# Altium schematic sheet Main.SchDoc
size 384 x 574 mm; SheetNumber: 1
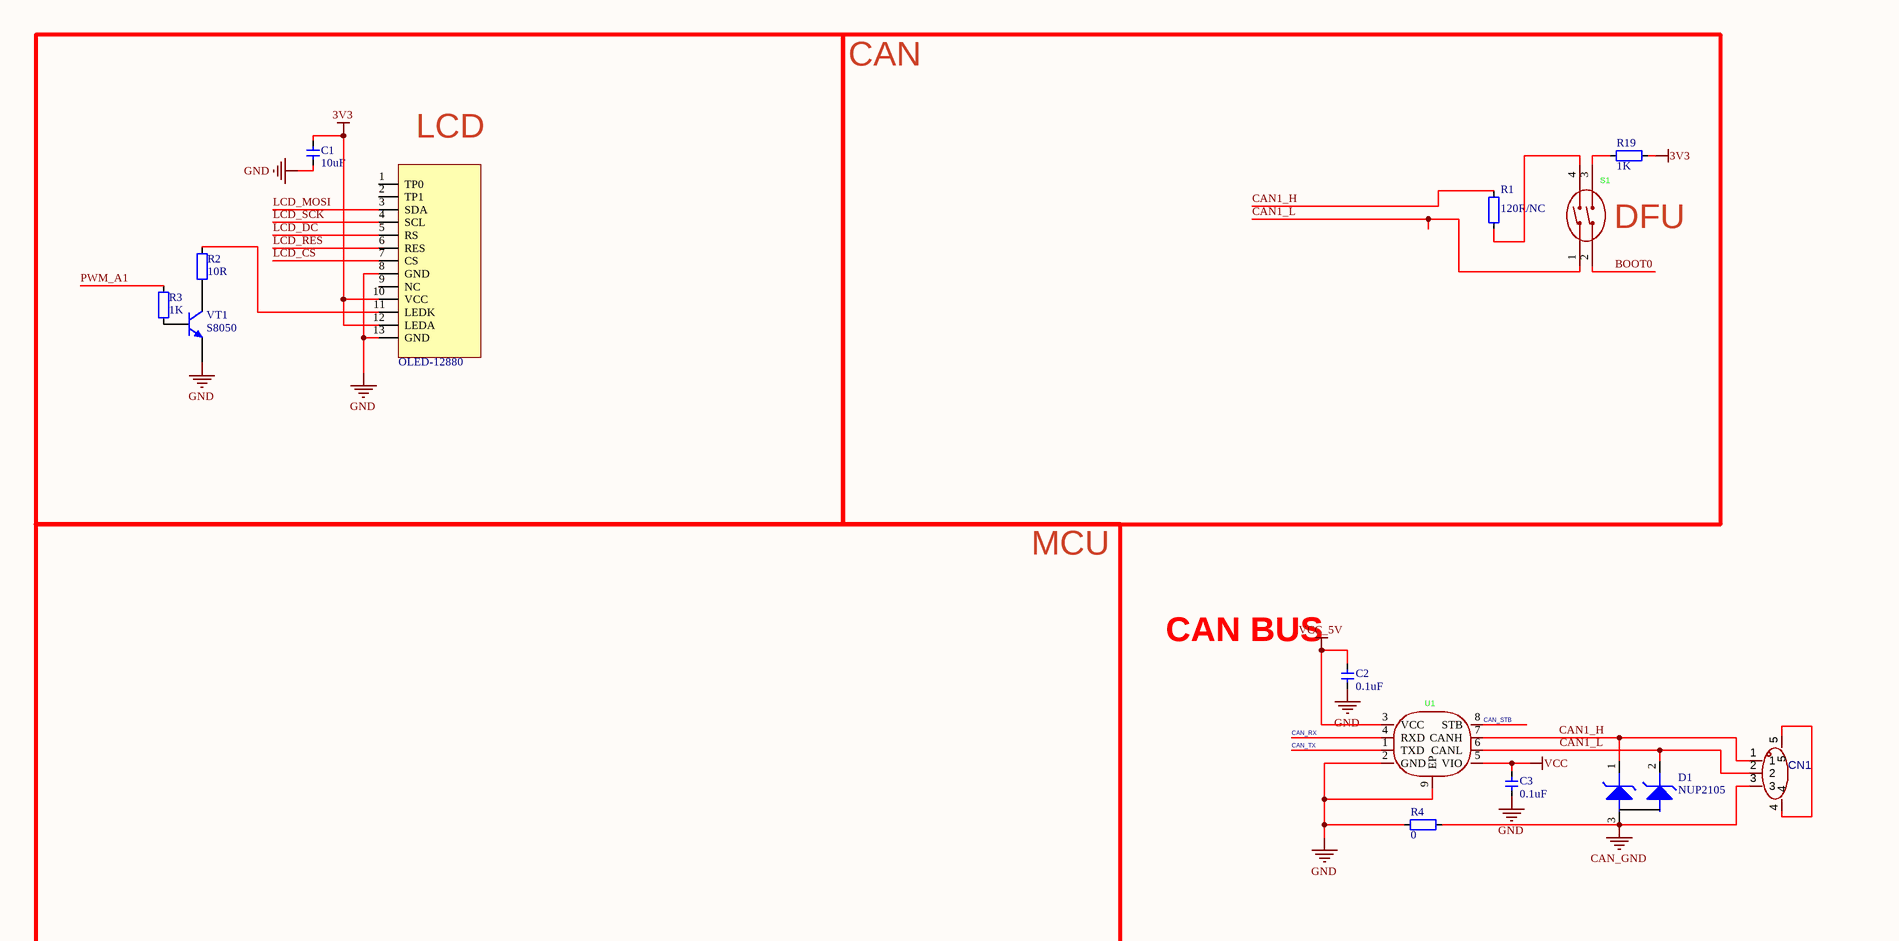
[diagram p0: Main.SchDoc, top]
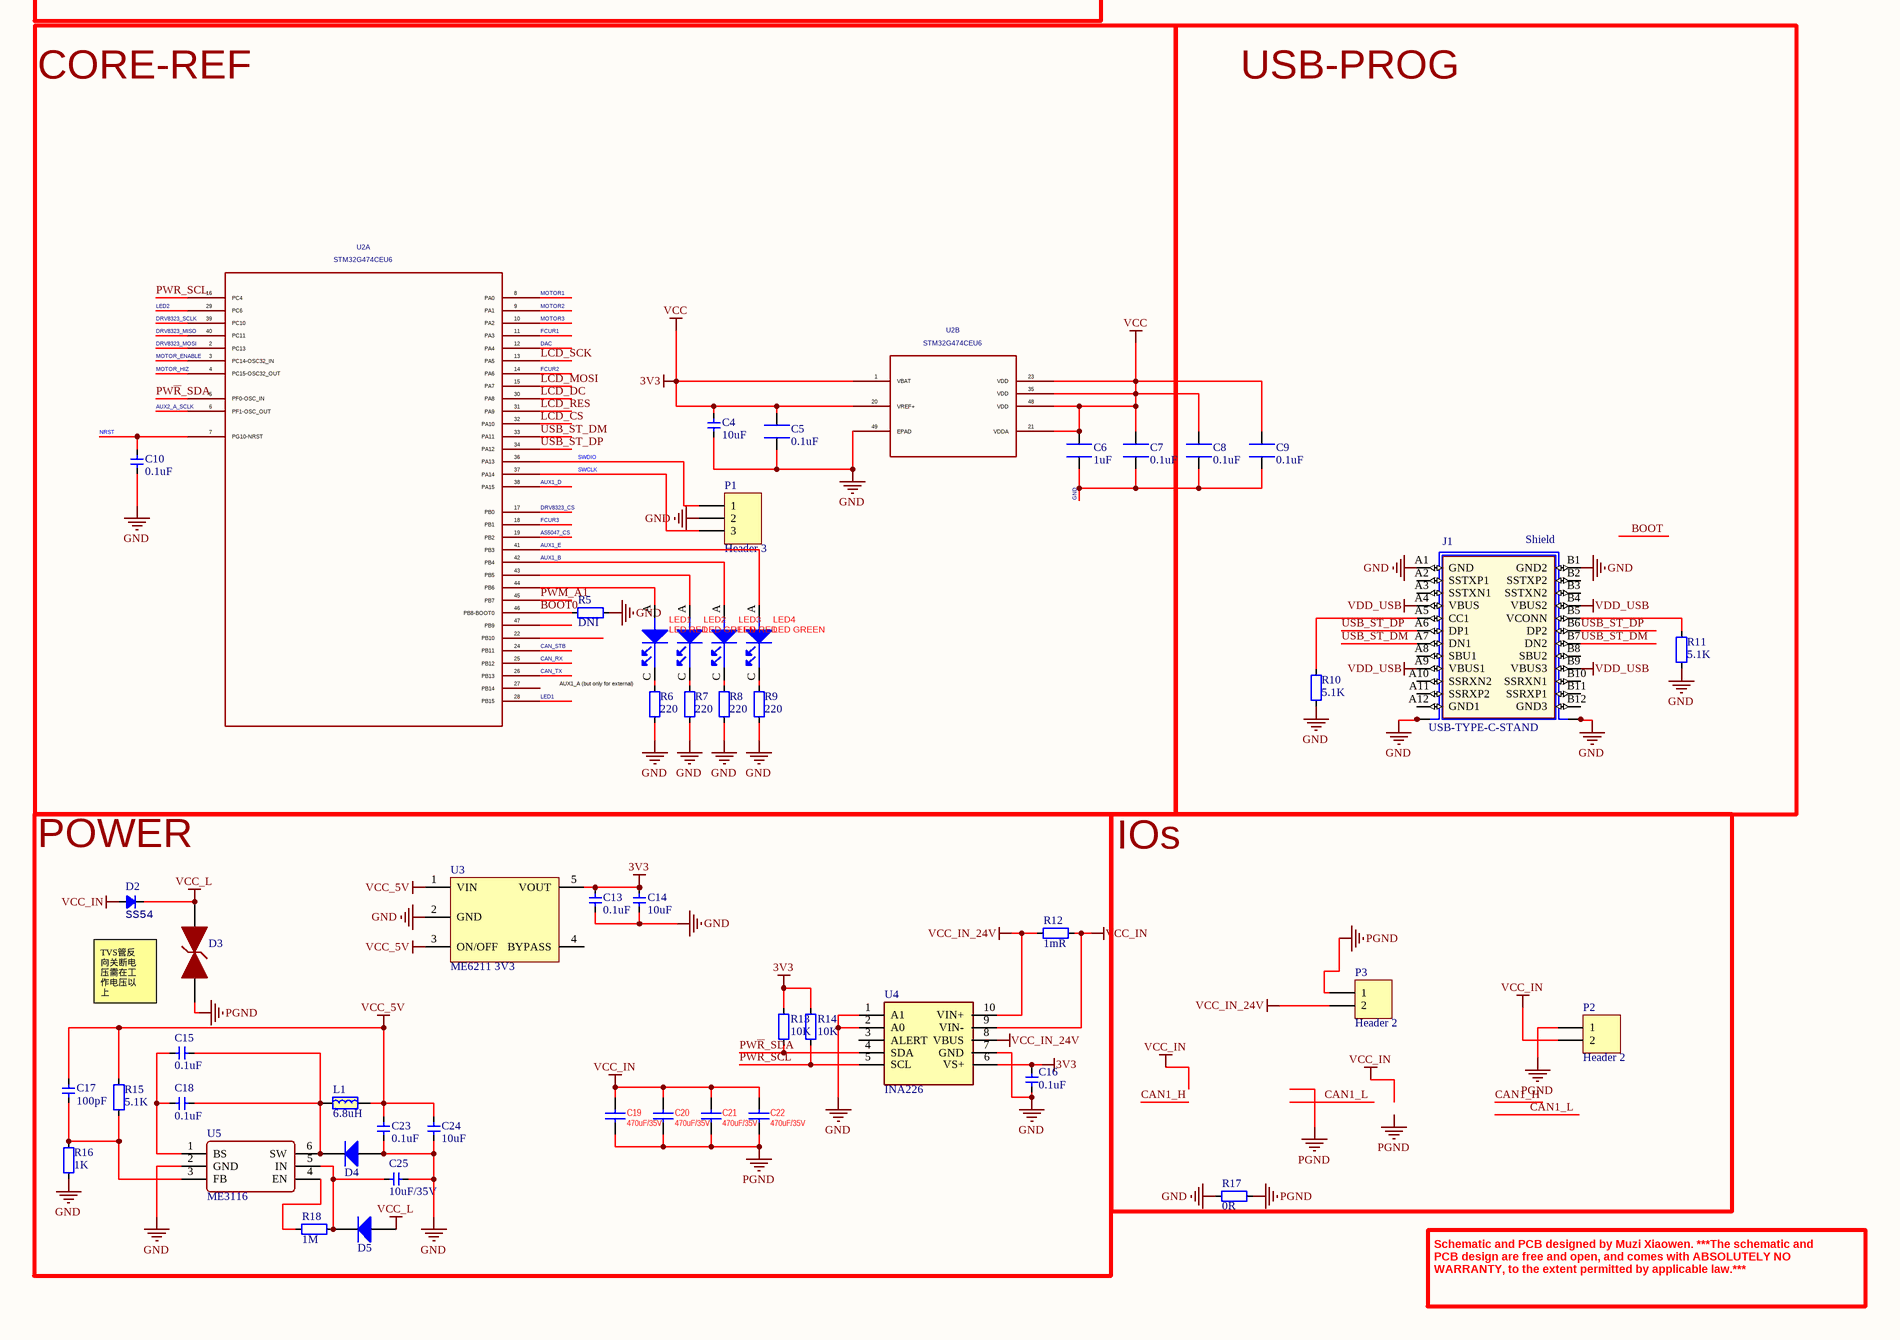
[diagram p1: Main.SchDoc, bottom]

## Parts
1  OLED-12880  [OLED-12880]
C1  10uF  [CAP_0402]
C2  0.1uF  [CAP_0402]
C3  0.1uF  [CAP_0402]
C4  10uF  [CAP_0402]
C5  0.1uF  [CAP_0402]
C6  1uF  [CAP_0402]
C7  0.1uF  [CAP_0402]
C8  0.1uF  [CAP_0402]
C9  0.1uF  [CAP_0402]
C10  0.1uF  [CAP_0402]
C13  0.1uF  [CAP_0402]
C14  10uF  [CAP_0402]
C15  0.1uF  [CAP_0402]
C16  0.1uF  [CAP_0402]
C17  100pF  [CAP_0402]
C18  0.1uF  [CAP_0402]
C19  value 470uF/35V  [CAP-SMD_BD10.0-L10.3-W10.3-LS11.3-FD]  (hidden comment: 220uF/25V)
C20  value 470uF/35V  [CAP-SMD_BD10.0-L10.3-W10.3-LS11.3-FD]  (hidden comment: 220uF/25V)
C21  value 470uF/35V  [CAP-SMD_BD10.0-L10.3-W10.3-LS11.3-FD]  (hidden comment: 220uF/25V)
C22  value 470uF/35V  [CAP-SMD_BD10.0-L10.3-W10.3-LS11.3-FD]  (hidden comment: 220uF/25V)
C23  0.1uF  [CAP_0402]
C24  10uF  [CAP_0402]
C25  10uF/35V  [C0603]
CN1  WAFER-GH1.25-3PLT-W1-P  [CONN-SMD_WAFER-GH1.25-3PLT-W1-P]  (value not drawn)
D1  NUP2105  [SOT23-3]
D2  SS54  [DO-214AC]
D3  SMBJ28CA  [SMBJ-CA_MFG]  (value not drawn)
D4  二极管-5819W  [SOD-323]  (value not drawn)
D5  二极管-5819W  [SOD-323]  (value not drawn)
J1  USB-TYPE-C-STAND  [USB-TYPE-C-STAND]
L1  6.8uH  [IND-201612]
LED1  LED RED  [LED0402-R-RD]
LED2  LED GREEN  [LED0402-R-RD]
LED3  LED RED  [LED0402-R-RD]
LED4  LED GREEN  [LED0402-R-RD]
P1  Header 3  [HDR1X3]
P2  Header 2  [CONN-TH_2P-P3.81_L7.4-W7.6]
P3  Header 2  [CONN-TH_2P-P3.81_L7.4-W7.6]
R1  120R/NC  [RES_0402_1]
R2  10R  [RES_0402_1]
R3  1K  [RES_0402_1]
R4  0  [RES_0402]
R5  DNI  [RES_0402]
R6  220  [RES_0402_1]
R7  220  [RES_0402_1]
R8  220  [RES_0402_1]
R9  220  [RES_0402_1]
R10  5.1K  [RES_0402_1]
R11  5.1K  [RES_0402_1]
R12  1mR  [RES-SMD_L6.4-W3.2-R2512]
R13  10K  [RES_0402_1]
R14  10K  [RES_0402_1]
R15  5.1K  [RES_0402_1]
R16  1K  [RES_0402_1]
R17  0R  [1206-RES]
R18  1M  [RES_0402_1]
R19  1K  [RES_0402_1]
S1  ZX-1.27BM-2PSMD  [SW-SMD_2P-L5.4-W4.1-P1.27-LS8.4]  (value not drawn)
U1  TCAN1057AVDRBRQ1  [SOIC8_2]  (value not drawn)
U2  value STM32G474CEU6  [moteus:UFQFPN-48_7X7X0P55MM]  (hidden comment: moteus_STM32G474CEU6)  (parts A,B of 2)
U3  ME6211 3V3  [SOT23-5]
U4  INA226  [MSOP-10_L3.0-W3.0-P0.50-LS5.0-BL]
U5  ME3116  [SOT23-6]
VT1  S8050  [SMT_TRIODE_NPN]

## Blocks framed on the sheet
LCD: 1 C1 R2 R3 VT1
CORE-REF: C4-C7 C10 LED1-LED4 P1 R5-R9 U2
USB-PROG: C8 C9 J1 R10 R11
POWER: C13-C25 D2-D5 L1 R12-R16 R18 U3-U5
IOs: P2 P3 R17

## Nets
3V3: 1.10(VCC) 1.12(LEDA) C1.2 C3.1 C4.2 C5.1 C6.1 C7.2 C8.1 C9.1 C13.2 C14.2 C16.2 R13.2 R14.2 R19.2 U1.5(VIO) U2.1(VBAT) U2.20(VREF+) U2.21(VDDA) U2.23(VDD) U2.35(VDD) U2.48(VDD) U3.5(VOUT) U4.6(VS+)  [also labelled VCC]
CAN_GND: CN1.3 D1.3(A) R4.2
GND: 1.8(GND) 1.13(GND) C1.1 C2.2 C3.2 C4.1 C5.2 C6.2 C7.1 C8.2 C9.2 C10.1 C13.1 C14.1 C16.1 C23.1 C24.1 C25.2 D4.1(A) J1.A1(GND) J1.B1(GND2) J1.S1(SHIELD) J1.S2(SHIELD) J1.S3(SHIELD1) J1.S4(SHIELD1) P1.2 R4.1 R5.2 R6.1 R7.1 R8.1 R9.1 R10.2 R11.2 R16.1 R17.1 U1.2(GND) U1.9(EP) U2.49(EPAD) U3.2(GND) U4.1(A1) U4.2(A0) U4.7(GND) U5.2(GND) VT1.2(E)
PGND: C19.2 C20.2 C21.2 C22.2 D3.1 P2.1 P3.1 R17.2
VCC_5V: C2.1 C17.1 C23.2 C24.2 L1.2 R15.2 U1.3(VCC) U3.1(VIN) U3.3(ON/OFF)
VCC_IN: C19.1 C20.1 C21.1 C22.1 D2.1(A) P2.2 R12.2 U4.9(VIN-)
VCC_IN_24V: P3.2 R12.1 U4.8(VBUS) U4.10(VIN+)
VCC_L: D2.2(K) D3.2 D5.1(A)
VDD_USB: J1.A4(VBUS) J1.A9(VBUS1) J1.B4(VBUS2) J1.B9(VBUS3)
AS5047_CS: U2.19(PB2)
AUX1_B: LED3.A(ANODE) U2.42(PB4)
AUX1_D: U2.38(PA15)
AUX1_E: LED4.A(ANODE) U2.41(PB3)
AUX2_A_SCLK: U2.6(PF1-OSC_OUT)
BOOT0: R5.1 S1.2 U2.46(PB8-BOOT0)
CAN1_H: CN1.1 D1.1(C) R1.1 U1.7(CANH)
CAN1_L: CN1.2 D1.2(C) S1.1 U1.6(CANL)
CAN_RX: U1.4(RXD) U2.25(PB12)
CAN_STB: U1.8(STB) U2.24(PB11)
CAN_TX: U1.1(TXD) U2.26(PB13)
DAC: U2.12(PA4)
DRV8323_CS: U2.17(PB0)
DRV8323_MISO: U2.40(PC11)
DRV8323_MOSI: U2.2(PC13)
DRV8323_SCLK: U2.39(PC10)
FCUR1: U2.11(PA3)
FCUR2: U2.14(PA6)
FCUR3: U2.18(PB1)
LCD_CS: 1.7(CS) U2.32(PA10)
LCD_DC: 1.5(RS) U2.30(PA8)
LCD_MOSI: 1.3(SDA) U2.15(PA7)
LCD_RES: 1.6(RES) U2.31(PA9)
LCD_SCK: 1.4(SCL) U2.13(PA5)
LED1: U2.28(PB15)
LED2: U2.29(PC6)
MOTOR1: U2.8(PA0)
MOTOR2: U2.9(PA1)
MOTOR3: U2.10(PA2)
MOTOR_ENABLE: U2.3(PC14-OSC32_IN)
MOTOR_HIZ: U2.4(PC15-OSC32_OUT)
NRST: C10.2 U2.7(PG10-NRST)
PWM_A1: R3.1 U2.45(PB7)
PW~{R}_SDA: R13.1 U2.5(PF0-OSC_IN) U4.4(SDA)
PWR_SCL: R14.1 U2.16(PC4) U4.5(SCL)
SWCLK: P1.3 U2.37(PA14)
SWDIO: P1.1 U2.36(PA13)
USB_ST_DM: J1.A7(DN1) J1.B7(DN2) U2.33(PA11)
USB_ST_DP: J1.A6(DP1) J1.B6(DP2) U2.34(PA12)
Net1_11: 1.11(LEDK) R2.2
NetC15_1: C15.1 C18.1 D4.2(K) L1.1 U5.6(SW)
NetC15_2: C15.2 C18.2 U5.1(BS)
NetC17_2: C17.2 R15.1 R16.2 U5.3(FB)
NetC25_1: C25.1 D5.2(K) R18.1 U5.5(IN)
NetCN1_4: CN1.4 CN1.5
NetJ1_A5: J1.A5(CC1) R10.1
NetJ1_B5: J1.B5(VCONN) R11.1
NetLED1_A: LED1.A(ANODE) U2.44(PB6)
NetLED1_C: LED1.C(CATHODE) R6.2
NetLED2_A: LED2.A(ANODE) U2.43(PB5)
NetLED2_C: LED2.C(CATHODE) R7.2
NetLED3_C: LED3.C(CATHODE) R8.2
NetLED4_C: LED4.C(CATHODE) R9.2
NetR1_2: R1.2 S1.4
NetR2_1: R2.1 VT1.3(C)
NetR3_2: R3.2 VT1.1(B)
NetR18_2: R18.2 U5.4(EN)
NetR19_1: R19.1 S1.3

Not connected (* = marked no-connect by the designer): 1 1(TP0) 2(TP1) 9(NC); J1 A2(SSTXP1) A3(SSTXN1) A8(SBU1) A10(SSRXN2) A11(SSRXP2) A12(GND1) B2(SSTXP2) B3(SSTXN2) B8(SBU2) B10(SSRXN1) B11(SSRXP1) B12(GND3); U2 22(PB10) 27(PB14) 47(PB9); U3 4(BYPASS); U4 3(ALERT)

## Notes on the sheet
- CAN
- (near S1) DFU
- MCU
- CAN BUS
- AUX1_A (but only for external)
- TVS管反
  向关断电
  压需在工
  作电压以
  上
- Schematic and PCB designed by Muzi Xiaowen. ***The schematic and PCB design are free and open, and comes with ABSOLUTELY NO WARRANTY, to the extent permitted by applicable law.***
- Labels drawn without touching a wire or pin: PGND
- (in symbol USB-TYPE-C-STAND) Shield

## Library data of the parts
1 = LCD-ST7735
C1-C4 C10 C13-C18 C23 C24 = 电容-0402: Capacitor; Value: 0.1u
C5 C7-C9 = GRM188R71H104KA93D: CAP CER 0.1UF 50V X7R 0603; Manufacturer: Murata Electronics North America; Tolerance: ±10%; Supplier 1: Digi-Key; Supplier Part Number 1: 490-1519-2-ND; Manufacturer Part Number: GRM188R71H104KA93D; RoHS: RoHS Compliant; Category: Capacitors; Pricing 1: 4000=0.01822, 8000=0.01663, 12000=0.01584 (USD); Packaging: Tape & Reel (TR); Capacitance: 0.1uF; Voltage - Rated: 50V; Temperature Coefficient: X7R; Mounting Type: Surface Mount, MLCC; Operating Temperature: -55°C ~ 125°C; Applications: General Purpose; Ratings: -; Package / Case: 0603 (1608 Metric); Size / Dimension: 0.063" L x 0.032" W (1.60mm x 0.80mm); Height - Seated (Max): -; Thickness (Max): 0.035" (0.90mm); Lead Spacing: -; Features: -; Lead Style: -; ComponentLink1URL: http://www.murata.com/~/media/webrenewal/support/library/catalog/products/capacitor/mlcc/c02e.ashx?la=en-us; ComponentLink1Description: http://www.murata.com/~/media/webrenewal/support/library/catalog/products/capacitor/mlcc/c02e.ashx?la=en-us; Stock: 19812000; Part Status: Active; Supplier 2: Digi-Key; Supplier Part Number 2: 490-1519-1-ND; Pricing 2: 1=0.12, 10=0.084, 100=0.0396, 500=0.02778, 1000=0.023 (USD)
C6 = GRM188R71H104KA93D: CAP CER 1UF 50V X7R 0603; Manufacturer: Murata Electronics North America; Tolerance: ±10%; Supplier 1: Digi-Key; Supplier Part Number 1: 490-1519-2-ND; Manufacturer Part Number: GRM188R71H104KA93D; RoHS: RoHS Compliant; Category: Capacitors; Pricing 1: 4000=0.01822, 8000=0.01663, 12000=0.01584 (USD); Packaging: Tape & Reel (TR); Capacitance: 1uF; Voltage - Rated: 50V; Temperature Coefficient: X7R; Mounting Type: Surface Mount, MLCC; Operating Temperature: -55°C ~ 125°C; Applications: General Purpose; Ratings: -; Package / Case: 0603 (1608 Metric); Size / Dimension: 0.063" L x 0.032" W (1.60mm x 0.80mm); Height - Seated (Max): -; Thickness (Max): 0.035" (0.90mm); Lead Spacing: -; Features: -; Lead Style: -; ComponentLink1URL: http://www.murata.com/~/media/webrenewal/support/library/catalog/products/capacitor/mlcc/c02e.ashx?la=en-us; ComponentLink1Description: http://www.murata.com/~/media/webrenewal/support/library/catalog/products/capacitor/mlcc/c02e.ashx?la=en-us; Stock: 19812000; Part Status: Active; Supplier 2: Digi-Key; Supplier Part Number 2: 490-1519-1-ND; Pricing 2: 1=0.12, 10=0.084, 100=0.0396, 500=0.02778, 1000=0.023 (USD)
C19-C22 = CAP: Capacitor, chip, ceramic; Parameters: E22 CAP; PN: RVT1E221M0607; Price: 0.038
C25 = 电容-0402: Capacitor; Value: 22uF 35V
D2 = Diode_SMA: Diode; Type: SMA; Value: SS54
D4 D5 = 二极管-5819W: 40V
J1 = USB-TYPE-C-STAND: MP: 632722110112; MF: Wurth Electronics; SnapEDA_Link: https://www.snapeda.com/parts/632722110112/Wurth%20Electronics%20Inc./view-part/3596593/?ref=snap; Price: None; DigiKey-Purchase-URL: https://snapeda.com/shop?store=DigiKey&id=3596593; Package: None; Availability: Unavailable; Value: *
L1 = 电感-201612
LED1-LED4 = LED: LED GRN SGL RA 25mA 4.1V SMD; CLASS: IC; CAD_APPROVED: Yes; MFG_PN01: AA4040ZGS; MFG_NAME01: Kingbright; AGILE_PN: 370-76642; PN: 19-217/G7C-AN1P2/3T; HEIGHT: 4.25MM; ROHS: Yes
P1 = Header 3: Header, 3-Pin; LatestRevisionDate: 17-Jul-2002; LatestRevisionNote: Re-released for DXP Platform.; Publisher: Altium Limited
P2 P3 = Header 2: Header, 2-Pin; LatestRevisionDate: 17-Jul-2002; LatestRevisionNote: Re-released for DXP Platform.; Publisher: Altium Limited
R1 R3 R10 R11 R13-R16 R18 = 电阻-0402: Resistor; Value: 22R
R2 R4-R9 R19 = 电阻-0402: Resistor
  R2: Value: 10R
  R4: Value: 0
  R5: Value: DNI
  R6-R9: Value: 220
  R19: Value: 1K
R12 R17 = 电阻-1206: Resistor
  R12: Value: 1mR
  R17: Value: 0R
S1 = ZX-1.27BM-2PSMD: Manufacturer: Megastar(兆星); Add into BOM: yes; Circuit: 单刀单掷; Number of Positions: 2位; Pin Style: 鸥翼型; Current Rating: 25mA; Voltage Rating: 24V; Operating Life: 3千次; Symbol: ZX-1.27BM-2PSMD; Device: ZX-1.27BM-2PSMD; LCSC Part Name: 间距1.27mm 平拨,凹槽式 2位拨码开关; Supplier Part: C7462922; Manufacturer Part: ZX-1.27BM-2PSMD; Supplier Footprint: SMD-4P,4.1x5.4mm; JLCPCB Part Class: Extended Part; Datasheet: https://atta.szlcsc.com/upload/public/pdf/source/20231012/60E7F445862B8AF86BF5174C6B4E0EC9.pdf; Supplier: LCSC; Convert to PCB: yes; Type: 平拨,凹槽式; Lead Pitch: 1.27mm; Operating Temperature: -30℃~+85℃; Color: 黑色
U1 = SIT1042ATK/3: Manufacturer: SIT(芯力特); Add into BOM: yes; Data Rate: 5Mbps; Supply Voltage: 4.5V~5.5V; Symbol: SIT1042ATK/3; Device: SIT1042ATK/3; LCSC Part Name: SIT1042A CAN FD待机模式总线收发器; Supplier Part: C5382546; Manufacturer Part: SIT1042ATK/3; Supplier Footprint: DFN-8(3x3); JLCPCB Part Class: Extended Part; Datasheet: https://atta.szlcsc.com/upload/public/pdf/source/20240906/0721301B0EA65A9C8E3ABE7B44C999B5.pdf; Supplier: LCSC; Convert to PCB: yes; Type: CAN-FD收发器; Supply Current: -; Operating Temperature: -40℃~+150℃
U2 = moteus_STM32G474CEU6: MF: ST; POPULATE: 1; ki_fp_filters: UFQFPN-48_7X7X0P55MM UFQFPN-48_7X7X0P55MM-M UFQFPN-48_7X7X0P55MM-L; UniqueId: eac3f191c372887e; AddInBom: yes; Device: moteus_STM32G474CEU6; Symbol: moteus_STM32G474CEU6; UserDocLink: STM32G474CEU6; MPN: STM32G474CEU6; ki_keywords: STM32G474CEU6; FootprintName: moteus:UFQFPN-48_7X7X0P55MM
U3 = LP2992: LDO
U4 = INA226: Manufacturer_Name: CTS; Manufacturer_Part_Number: 218-4LPSTJ; Geometry.Height: 2.7mm; Mouser Part Number: 774-218-4LPSTJ; Mouser Price/Stock: https://www.mouser.co.uk/ProductDetail/CTS-Electronic-Components/218-4LPSTJ?qs=qNzHFtQhdJ%2Frpuf7cnHHWA%3D%3D; Datasheet Link: https://www.ctscorp.com/wp-content/uploads/218.pdf
U5 = ME3116: DC-DC
VT1 = SMT_TRIODE_NPN: Surface mount NPN transistor, package SOT-23
CN1 = WAFER-GH1.25-3PLT-W1-P: Symbol: WAFER-GH1.25-3PLT-W1-P